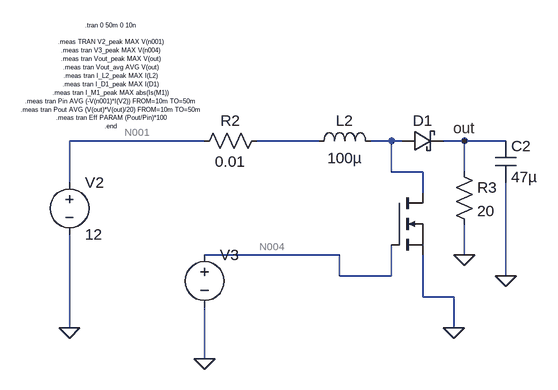
[diagram p0: schematic Booster.asc]
Booster.asc, the LTspice schematic file:
Version 4.1
SHEET 1 1316 836
WIRE 192 480 -16 480
WIRE 368 480 272 480
WIRE 480 480 448 480
WIRE 496 480 480 480
WIRE 592 480 560 480
WIRE 656 480 592 480
WIRE 480 528 480 480
WIRE 528 528 480 528
WIRE 592 528 592 480
WIRE -16 544 -16 480
WIRE 528 560 528 528
WIRE 400 656 192 656
WIRE 592 656 592 608
WIRE 400 688 400 656
WIRE 480 688 480 640
WIRE 480 688 400 688
WIRE 656 688 656 544
WIRE 528 720 528 656
WIRE 576 720 528 720
WIRE -16 768 -16 624
WIRE 576 768 576 720
WIRE 192 816 192 736
FLAG -16 768 0
FLAG 192 816 0
FLAG 592 656 0
FLAG 656 688 0
FLAG 576 768 0
FLAG 592 480 out
SYMBOL voltage -16 528 R0
WINDOW 123 0 0 Left 0
WINDOW 39 0 0 Left 0
SYMATTR InstName V2
SYMATTR Value 12
SYMBOL res 288 464 R90
WINDOW 0 0 56 VBottom 2
WINDOW 3 32 56 VTop 2
SYMATTR InstName R2
SYMATTR Value 0.01
SYMATTR SpiceLine tol=1 pwr=0.1
SYMBOL ind 352 496 R270
WINDOW 0 32 56 VTop 2
WINDOW 3 5 56 VBottom 2
SYMATTR InstName L2
SYMATTR Value 100µ
SYMATTR SpiceLine Ipk=4 Rser=0.1 Cpar=0
SYMBOL voltage 192 640 R0
WINDOW 123 0 0 Left 0
WINDOW 39 0 0 Left 0
WINDOW 3 24 96 Invisible 2
SYMATTR InstName V3
SYMATTR Value PULSE(0 10 0 10n 10n 4u 10u)
SYMBOL cap 640 480 R0
SYMATTR InstName C2
SYMATTR Value 47µ
SYMATTR SpiceLine V=25 Irms=1.86 Rser=0.065 Lser=0 mfg="Vishay" pn="T55D476M025" type="Tantalum Polymer"
SYMBOL res 576 512 R0
SYMATTR InstName R3
SYMATTR Value 20
SYMATTR SpiceLine tol=1 pwr=0.1
SYMBOL nmos 480 560 R0
WINDOW 0 56 32 Invisible 2
WINDOW 3 56 72 Invisible 2
SYMATTR InstName M1
SYMATTR Value IRF7401
SYMBOL schottky 496 496 R270
WINDOW 0 32 32 VTop 2
WINDOW 3 0 32 Invisible 2
SYMATTR InstName D1
SYMATTR Value MBRS340
SYMATTR Description Diode
SYMATTR Type diode
TEXT 48 464 Bottom 0 !.tran 0 50m 0 10n\n \n.meas TRAN V2_peak MAX V(n001)\n.meas tran V3_peak MAX V(n004)\n.meas tran Vout_peak MAX V(out)\n.meas tran Vout_avg AVG V(out)\n.meas tran I_L2_peak MAX I(L2)\n.meas tran I_D1_peak MAX I(D1)\n.meas tran I_M1_peak MAX abs(Is(M1))\n.meas tran Pin AVG (-V(n001)*I(V2)) FROM=10m TO=50m\n.meas tran Pout AVG (V(out)*V(out)/20) FROM=10m TO=50m\n.meas tran Eff PARAM (Pout/Pin)*100\n.end

The netlist it stands for:
* Booster.asc
V2 N001 0 12
R2 N002 N001 0.01 tol=1 pwr=0.1
L2 N002 N003 100µ Ipk=4 Rser=0.1 Cpar=0
V3 N004 0 PULSE(0 10 0 10n 10n 4u 10u)
C2 out 0 47µ V=25 Irms=1.86 Rser=0.065 Lser=0 mfg="Vishay" pn="T55D476M025" type="Tantalum Polymer"
R3 out 0 20 tol=1 pwr=0.1
M1 N003 N004 0 0 IRF7401
D1 N003 out MBRS340
.model D D
.lib standard.dio
.model NMOS NMOS
.model PMOS PMOS
.lib standard.mos
.tran 0 50m 0 10n
.meas TRAN V2_peak MAX V(n001)
.meas tran V3_peak MAX V(n004)
.meas tran Vout_peak MAX V(out)
.meas tran Vout_avg AVG V(out)
.meas tran I_L2_peak MAX I(L2)
.meas tran I_D1_peak MAX I(D1)
.meas tran I_M1_peak MAX abs(Is(M1))
.meas tran Pin AVG (-V(n001)*I(V2)) FROM=10m TO=50m
.meas tran Pout AVG (V(out)*V(out)/20) FROM=10m TO=50m
.meas tran Eff PARAM (Pout/Pin)*100
.end
.backanno
.end